# Altium schematic sheet Motor-Z.SchDoc: Motor-Z
size Letter; DocumentNumber: 4; SheetNumber: 7; SheetTotal: 11
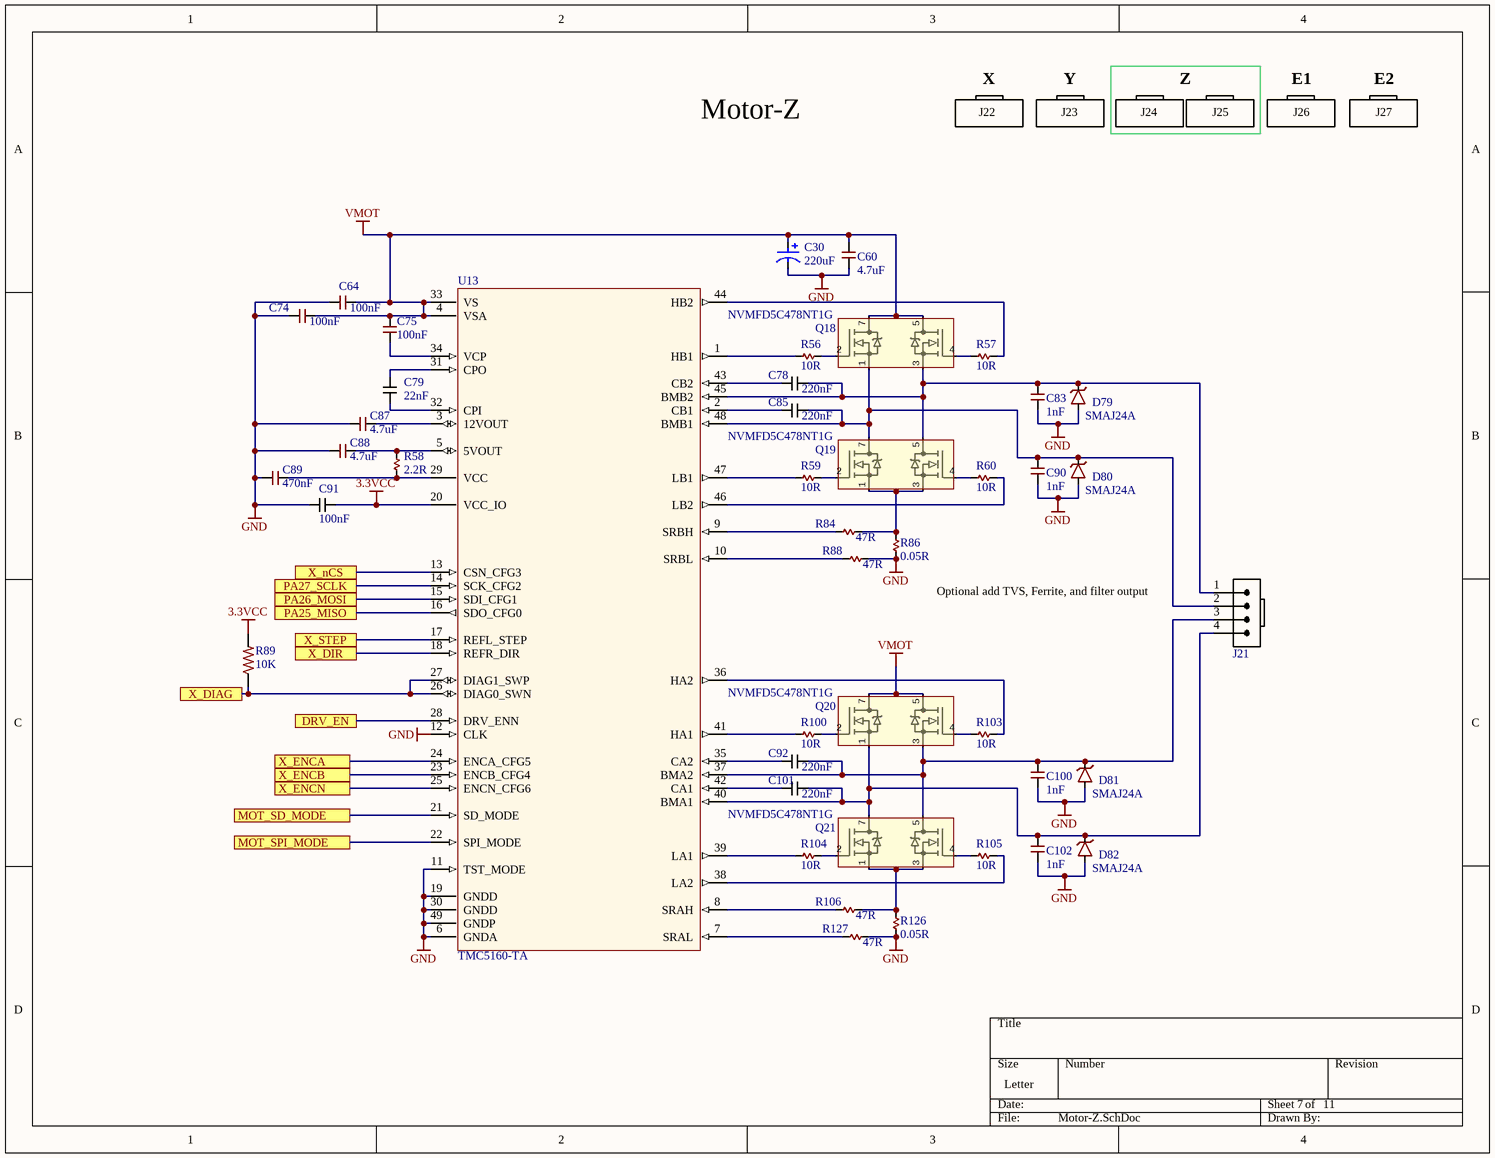
[diagram p0: Motor-Z.SchDoc]

## Parts
C30  220uF  [CAP10X10]
C60  4.7uF  [C1206]
C64  100nF  [C0603]
C74  100nF  [C0603]
C75  100nF  [C0603]
C78  220nF  [C0603]
C79  22nF  [C0603]
C83  1nF  [C0603]
C85  220nF  [C0603]
C87  4.7uF  [C1206]
C88  value 4.7uF  [C0603]  (hidden comment: 4.7uF 6.3V 0603)
C89  value 470nF  [C0402]  (hidden comment: 0402)
C90  1nF  [C0603]
C91  100nF  [C0201 Large Pads]
C92  220nF  [C0603]
C100  1nF  [C0603]
C101  220nF  [C0603]
C102  1nF  [C0603]
D79  SMAJ24A  [SMA-SM]
D80  SMAJ24A  [SMA-SM]
D81  SMAJ24A  [SMA-SM]
D82  SMAJ24A  [SMA-SM]
J21  Molex 0705430003  [4POL254 PIN-IN-PASTE]  (value not drawn)
Q18  NVMFD5C478NT1G  [SO8FL-Dual (DFN8 5x6, 1.26P Dual Flag)]
Q19  NVMFD5C478NT1G  [SO8FL-Dual (DFN8 5x6, 1.26P Dual Flag)]
Q20  NVMFD5C478NT1G  [SO8FL-Dual (DFN8 5x6, 1.26P Dual Flag)]
Q21  NVMFD5C478NT1G  [SO8FL-Dual (DFN8 5x6, 1.26P Dual Flag)]
R56  10R  [R0402]
R57  10R  [R0402]
R58  2.2R  [R0402]
R59  10R  [R0402]
R60  10R  [R0402]
R84  47R  [R0402]
R86  0.05R  [R2512]
R88  47R  [R0402]
R89  10K  [R0402]
R100  10R  [R0402]
R103  10R  [R0402]
R104  10R  [R0402]
R105  10R  [R0402]
R106  47R  [R0402]
R126  0.05R  [R2512]
R127  47R  [R0402]
U13  TMC5160-TA  [TQFP48-EP]

## Ports
DRV_EN, MOT_SD_MODE, MOT_SPI_MODE, PA25_MISO, PA26_MOSI, PA27_SCLK, X_DIAG, X_DIR, X_ENCA, X_ENCB, X_ENCN, X_nCS, X_STEP

## Nets
3.3VCC: C91.2 R89.2 U13.20(VCC_IO)
GND: C30.2 C60.1 C64.1 C74.1 C83.1 C87.1 C88.1 C89.1 C90.1 C91.1 C100.1 C102.1 D79.A D80.A D81.A D82.A R86.1 R88.2 R126.1 R127.2 U13.6(GNDA) U13.11(TST_MODE) U13.12(CLK) U13.19(GNDD) U13.30(GNDD) U13.49(GNDP)
VMOT: C30.1 C60.2 C64.2 C74.2 C75.2 Q18.5(D1) Q18.7(D2) Q20.5(D1) Q20.7(D2) U13.4(VSA) U13.33(VS)
DRV_EN: U13.28(DRV_ENN) ; port DRV_EN
MOT_SD_MODE: U13.21(SD_MODE) ; port MOT_SD_MODE
MOT_SPI_MODE: U13.22(SPI_MODE) ; port MOT_SPI_MODE
PA25_MISO: U13.16(SDO_CFG0) ; port PA25_MISO
PA26_MOSI: U13.15(SDI_CFG1) ; port PA26_MOSI
PA27_SCLK: U13.14(SCK_CFG2) ; port PA27_SCLK
X_DIAG: R89.1 U13.26(DIAG0_SWN) U13.27(DIAG1_SWP) ; port X_DIAG
X_DIR: U13.18(REFR_DIR) ; port X_DIR
X_ENCA: U13.24(ENCA_CFG5) ; port X_ENCA
X_ENCB: U13.23(ENCB_CFG4) ; port X_ENCB
X_ENCN: U13.25(ENCN_CFG6) ; port X_ENCN
X_nCS: U13.13(CSN_CFG3) ; port X_nCS
X_STEP: U13.17(REFL_STEP) ; port X_STEP
NetC75_1: C75.1 U13.34(VCP)
NetC78_1: C78.1 U13.43(CB2)
NetC78_2: C78.2 C83.2 D79.K J21.1 Q18.3(S1) Q19.5(D1) U13.45(BMB2)
NetC79_1: C79.1 U13.32(CPI)
NetC79_2: C79.2 U13.31(CPO)
NetC85_1: C85.1 U13.2(CB1)
NetC85_2: C85.2 C90.2 D80.K J21.2 Q18.1(S2) Q19.7(D2) U13.48(BMB1)
NetC87_2: C87.2 U13.3(12VOUT)
NetC88_2: C88.2 R58.2 U13.5(5VOUT)
NetC89_2: C89.2 R58.1 U13.29(VCC)
NetC92_1: C92.1 U13.35(CA2)
NetC92_2: C92.2 C100.2 D81.K J21.3 Q20.3(S1) Q21.5(D1) U13.37(BMA2)
NetC101_1: C101.1 U13.42(CA1)
NetC101_2: C101.2 C102.2 D82.K J21.4 Q20.1(S2) Q21.7(D2) U13.40(BMA1)
NetQ18_2: Q18.2(G2) R56.2
NetQ18_4: Q18.4(G1) R57.1
NetQ19_1: Q19.1(S2) Q19.3(S1) R84.2 R86.2
NetQ19_2: Q19.2(G2) R59.2
NetQ19_4: Q19.4(G1) R60.1
NetQ20_2: Q20.2(G2) R100.2
NetQ20_4: Q20.4(G1) R103.1
NetQ21_1: Q21.1(S2) Q21.3(S1) R106.2 R126.2
NetQ21_2: Q21.2(G2) R104.2
NetQ21_4: Q21.4(G1) R105.1
NetR56_1: R56.1 U13.1(HB1)
NetR57_2: R57.2 U13.44(HB2)
NetR59_1: R59.1 U13.47(LB1)
NetR60_2: R60.2 U13.46(LB2)
NetR84_1: R84.1 U13.9(SRBH)
NetR88_1: R88.1 U13.10(SRBL)
NetR100_1: R100.1 U13.41(HA1)
NetR103_2: R103.2 U13.36(HA2)
NetR104_1: R104.1 U13.39(LA1)
NetR105_2: R105.2 U13.38(LA2)
NetR106_1: R106.1 U13.8(SRAH)
NetR127_1: R127.1 U13.7(SRAL)

## Notes on the sheet
- X
- Y
- Z
- E1
- E2
- Motor-Z
- J22
- J23
- J24
- J25
- J26
- J27
- (near J21) Optional add TVS, Ferrite, and filter output

## Library data of the parts
C30 = 220uF Al-El 50V: CAP ALUM 220UF 20% 50V SMD; MANUFACTURER #: UCW1H221MNL1GS; MANUFACTURER: Nichicon; PART DESCRIPTION: 220µF 50V Aluminum Electrolytic Capacitors Radial, Can - SMD 7000 Hrs @ 105°C; EE_SPEC: 365mA@120Hz 730mA@100kHz 350mOhms; DISTRIBUTOR #: 493-9426-2-ND; DISTRIBUTOR: Digikey; PART: 220uF; TOLERANCE: 20%; VALUE: 220uF
C60 C87 = 4.7uF 1206 50V X5R: CAP CER 1206 4.7uF 50V 10% X5R; MANUFACTURER: Kemet; MANUFACTURER #: C1206C475K5PACTU; PART: 4.7uF 50V X5R 1206; PART DESCRIPTION: 4.7µF ±10% 50V Ceramic Capacitor X5R 1206 (3216 Metric); DISTRIBUTOR #: 399-5507-2-ND; DISTRIBUTOR: Digikey; TOLERANCE: 10%; EE_SPEC: 50V; VALUE: 4.7uF
C64 C74 C75 = 100nF 0603 50V X7R: CAP CER 0603 100nF 50V 10% X7R; MANUFACTURER: Kemet; MANUFACTURER #: C0603C104K5RACTU; PART: 100nF 50V X7R 0603; PART DESCRIPTION: 0.10µF ±10% 50V Ceramic Capacitor X7R 0603 (1608 Metric); DISTRIBUTOR #: 399-5089-2-ND; DISTRIBUTOR: Digikey; TOLERANCE: 10%; EE_SPEC: 50V; VALUE: 100nF
C78 C85 C92 C101 = 220nF 50V X7R 0603: CAP CER 0.22UF 50V X7R 0603; MANUFACTURER: TDK; MANUFACTURER #: CGA3E3X7R1H224K080AB; PART DESCRIPTION: 0.22µF ±10% 50V Ceramic Capacitor X7R 0603 (1608 Metric); EE_SPEC: 50V X7R; VALUE: 220nF
C79 = 22nF 100V X7R 0603: CAP CER 0.022UF 100V X7R 0603; MANUFACTURER: Kemet; MANUFACTURER #: C0603C223K1RACTU; PART DESCRIPTION: 0.022µF ±10% 100V Ceramic Capacitor X7R 0603 (1608 Metric); EE_SPEC: 100 X7R; VALUE: 22nF
C83 C90 C100 C102 = 1nF 50V X7R 0603: CAP CER 0603  1nF 50v 10% X7R; Manufacturer: Kemet; MANUFACTURER #: C0603C102K5RACTU; Part Description: 1000pF ±10% 50V Ceramic Capacitor X7R 0603 (1608 Metric); Tolerance: +/- 10%; VALUE: 1nF; DISTRIBUTOR #: 399-1082-2-ND; DISTRIBUTOR: Digi-Key; EE_SPEC: 1nF 50V X7R 0603; PART: 1nF
C88 = 4.7uF 0603 6.3V X7R: CAP CER 4.7UF 6.3V X7R 0603; MANUFACTURER: Samsung; MANUFACTURER #: CL10B475KQ8NQNC; PART DESCRIPTION: 4.7µF ±10% 6.3V Ceramic Capacitor X7R 0603 (1608 Metric); TOLERANCE: 10%; DISTRIBUTOR #: 1276-2087-2-ND; DISTRIBUTOR: Digikey; PART: 4.7uF; EE_SPEC: 6.3V
C89 = 470nF 0402 6.3V X5R: 470nF 6.3v C0402 - GRM155R60J474KE19D; PART DESCRIPTION: 470nF ±10% 6.3V Ceramic Capacitor X5R 0402 (1005 Metric); MANUFACTURER: Murata; PART: 0.47uF 6.3V X5R 0402; TOLERANCE: 10%; EE_SPEC: 6.3V; MANUFACTURER #: GRM155R60J474KE19D; DISTRIBUTOR #: 490-3266-2-ND; DISTRIBUTOR: Digikey
C91 = 100nF 6.3V X5R 0201: CAP CER 0.1UF 6.3V 10% X5R 0201; MANUFACTURER: Samsung; MANUFACTURER #: CL03A104KQ3NNNC; VALUE: 100nF; DISTRIBUTOR: DIGI-KEY; DISTRIBUTOR #: 1276-1013-1-ND; TOLERANCE: 10%; VOLTAGE: 6.3V
D79-D82 = SMAJ24A: TVS DIODE 24V 38.9V SMA; Manufacturer: Bourns Inc; EE_SPEC: 24Vrs 38.9Vc; MANUFACTURER #: SMAJ24A; DISTRIBUTOR #: SMAJ24ABTR-ND; DISTRIBUTOR: Digi-Key; Part Description: TVS DIODE 24V 38.9V SMA; VALUE: SMAJ24A
J21 = Molex 0705430003 PIP: Molex 4 Pin Clip Connector - Pin In Paste footprint
Q18-Q21 = NVMFD5C478NT1G: 40V 17 MOHM T6 S08FL DUAL; MANUFACTURER: ON Semiconductor; PART DESCRIPTION: Mosfet Array 2 N-Channel (Dual) 40V 9.8A (Ta), 27A (Tc) 3.1W (Ta), 23W (Tc) Surface Mount 8-DFN (5x6) Dual Flag (SO8FL-Dual); TOLERANCE: -NA-; MANUFACTURER #: NVMFD5C478NT1G; DISTRIBUTOR #: NVMFD5C478NT1GOSCT-ND; DISTRIBUTOR: Digikey; VALUE: NVMFD5C478NT1G; EE_SPEC: 40V 17 MOHM
R56 R57 R59 R60 R100 R103-R105 = 10R 1% 0402: RES SMD 10 OHM 1% 1/16W 0402; MANUFACTURER: Yageo; MANUFACTURER #: RC0402FR-0710RL; PART DESCRIPTION: 10 Ohm ±1% 0.063W, 1/16W Chip Resistor 0402 (1005 Metric) Moisture Resistant Thick Film; DISTRIBUTOR #: 311-10.0LRTR-ND; DISTRIBUTOR: Digikey; PART: 10R 1% 0402; TOLERANCE: 1%; EE_SPEC: 1/16W; VALUE: 10R
R58 = 2.2R 5% 0402: RES SMD 2.2 OHM 5% 1/16W 0402; MANUFACTURER: Yageo; MANUFACTURER #: RC0402JR-072R2L; Part Description: 2.2 Ohms ±5% 0.063W, 1/16W Chip Resistor 0402 (1005 Metric) Moisture Resistant Thick Film; Tolerance: +/- 5%; VALUE: 2.2R; EE_SPEC: 2.2R 5% 0402
R84 R88 R106 R127 = 47R 1% 0402: RES 47 OHM 1% 1/16W 0402; MANUFACTURER: Vishay Dale; MANUFACTURER #: CRCW040247R0FKEDC; Part Description: 47 Ohms ±1% 0.063W, 1/16W Chip Resistor 0402 (1005 Metric)  Thick Film; Tolerance: +/- 1%; VALUE: 47R; EE_SPEC: 47R 1% 0402
R86 R126 = 0.05R 1% 2512: RES 0.05 OHM 1% 2W 2512; MANUFACTURER: Stackpole; MANUFACTURER #: CSRN2512FK50L0; Part Description: 50 mOhms ±1% 2W Chip Resistor 2512 (6432 Metric) Current Sense Thick Film; Tolerance: +/- 1%; VALUE: 0.05R; EE_SPEC: 0.05R 1% 2512
R89 = RC0402FR-0710KP: RES SMD 10K OHM 1% 1/16W 0402; MANUFACTURER: Yageo; PART: 10k 1% 0402; PART DESCRIPTION: 10k Ohm ±1% 0.063W, 1/16W Chip Resistor 0402 (1005 Metric) Moisture Resistant Thick Film; VALUE: 10K; MANUFACTURER #: RC0402FR-0710KP; DISTRIBUTOR #: YAG1249TR-ND; DISTRIBUTOR: Digi-Key Electronics; TOLERANCE: 1%; EE_SPEC: 1/16W
U13 = TMC5160-TA: IC STEPPER MOTOR DVR TQFP48-EP; MANUFACTURER: Trinamic; EE_SPEC: 60V 1/256 Step; VALUE: TMC5160-TA; MANUFACTURER #: TMC5160-TA; Part Description: IC STEPPER MOTOR DVR TQFP48-EP